# Altium schematic sheet LAB-02.SchDoc
size A
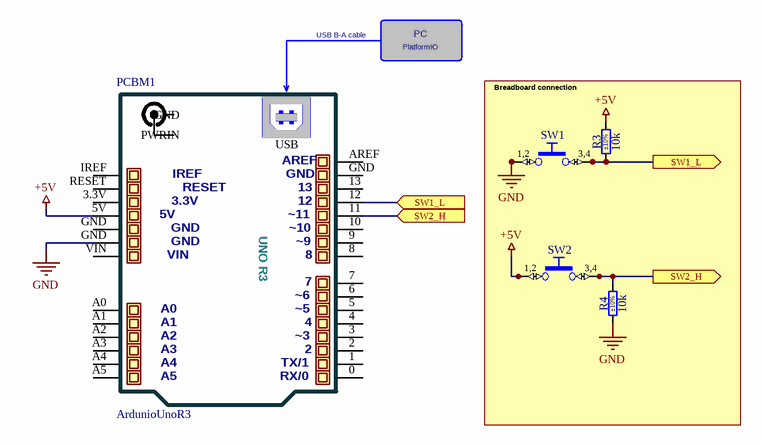
[diagram p0: LAB-02.SchDoc]

## Parts
PCBM1  ArdunioUnoR3
R3  10k  Tolerance: ±10%  [RESC3216X65N]
R4  10k  Tolerance: ±10%  [RESC3216X65N]
SW1  Push Button  [PB_ALPS_SKHHDTA010]  (value not drawn)
SW2  Push Button  [PB_ALPS_SKHHDTA010]  (value not drawn)

## Blocks framed on the sheet
Breadboard connection: R3 R4 SW1 SW2

## Ports
SW1_L (in), SW1_L (out), SW2_H (in), SW2_H (out)

## Nets
+5V: PCBM1.5V R3.2 SW2.1 SW2.2
GND: PCBM1.GND R4.1 SW1.1 SW1.2
SW1_L: PCBM1.12 R3.1 SW1.3 SW1.4 ; port SW1_L
SW2_H: PCBM1.11 R4.2 SW2.3 SW2.4 ; port SW2_H

Not connected (* = marked no-connect by the designer): PCBM1 0 1 2 3 3.3V 4 5 6 7 8 9 10 13 A0 A1 A2 A3 A4 A5 AREF IREF RESET VIN

## Notes on the sheet
- USB B-A cable
- PC
- PlatformIO
- (in symbol ArdunioUnoR3) PWRIN; USB; ~11; UNO R3; ~10; ~9; ~6; ~5; ~3; TX/1; RX/0
- (in symbol PB_ALPS_SKHHDTA010) 1,2; 3,4

## Library data of the parts
PCBM1 = ArdunioUnoR3: ArdunioUnoR3 Universal SCH Symbol / (C) 230232
R3 R4 = R1206_270R_0.1%_0.25W_25PPM: Resistor - 0.1%; Part Description: Thin Film Chip Resistor; Manufacturer: GENERIC; Manufacturer1 Part Number: RN73H2BTTD2700B25; Value: 270; Power: 0.25W; TC: ±25ppm/°C; PressFit: No; Part Number: R1206_270R_0.1%_0.25W_25PPM; Component Kind: Standard; Component Type: Standard; Pin Count: 2; Status: Not Recommended; Manufacturer Part Number: R1206_270R_0.1%_0.25W_25PPM; Case: 1206; Mounted: Yes; Sense: No; Socket: No; SMD: Yes; Manufacturer1 Example: KOA; Manufacturer1 ComponentHeight: 0.70mm; HelpURL: \\cern.ch\dfs\Applications\Altium\Datasheets\R1206_KOA_RN73H.pdf; Author: CERN DEM JLC; CreateDate: 3. 12. 2007; LatestRevisionDate: 13. 3. 2008
SW1 SW2 = PB_ALPS_SKHHDTA010: Push-Button Switch SPDT; Part Description: 12VDC 50mA, 6x6mm Model, 13mm Stem Height Vertical Pushbutton Switch, ALPS SKHH Series; Manufacturer: ALPS; PressFit: No; Sense Comment: Non-washable; Part Number: PB_ALPS_SKHHDTA010; Component Kind: Standard; Component Type: Standard; Pin Count: 4; PackageDescription: 6x6mm Model, 13mm Stem Height Vertical Pushbutton Switch, ALPS SKHH Series; Family: Push Button; Mounted: Yes; Socket: No; SMD: No; Sense: Yes; Status: None; Manufacturer Part Number: SKHHDTA010; ComponentHeight: 13mm; HelpURL: \\cern.ch\dfs\Applications\Altium\Datasheets\PB_ALPS_SKHHDTA010.pdf; Author: CERN DEM JLC; CreateDate: 26. 9. 2013; LatestRevisionDate: 26. 9. 2013